# Altium schematic sheet AFBR-TX-fiber_optic_transmiter_OPCn.SchDoc
size A4; SheetNumber: 4; SheetTotal: 4
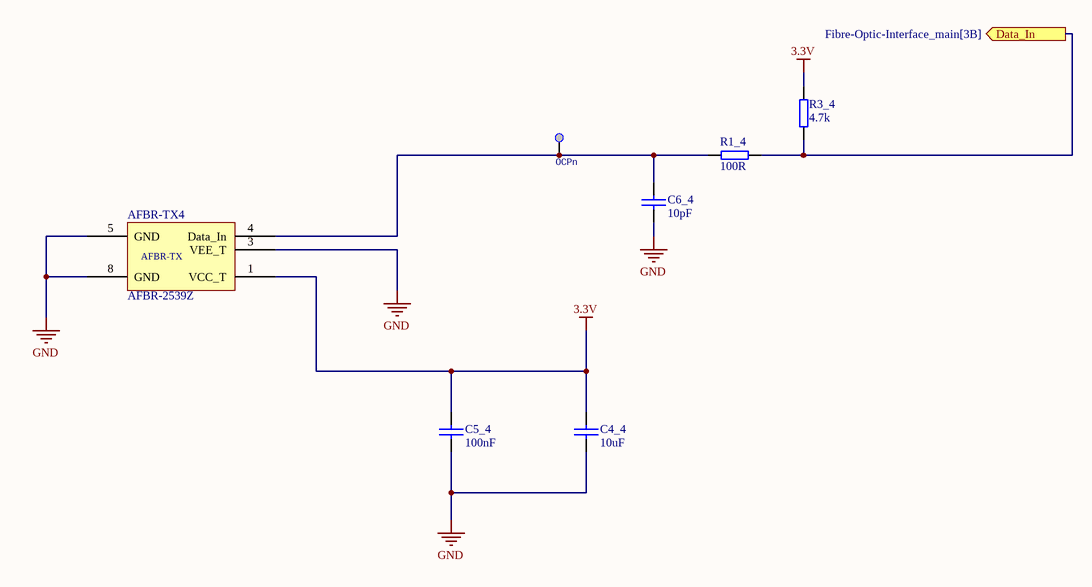
[diagram p0: AFBR-TX-fiber_optic_transmiter_OPCn.SchDoc]

## Parts
AFBR-TX4  AFBR-2539Z  [AFBR-TX/RX-HORIZONTAL]
C4_4  10uF  [1206]
C5_4  100nF  [0603C]
C6_4  10pF  [0603C]
OCPn  PK_1  [PK]  (value not drawn)  (no BOM)
R1_4  100R  [0603R]
R3_4  4.7k  [0603R]

## Ports
Data_In (out, see Fibre-Optic-Interface_main[3B])

## Nets
3.3V: AFBR-TX4.1(VCC_T) C4_4.1 C5_4.1 R3_4.2
GND: AFBR-TX4.3(VEE_T) AFBR-TX4.5(GND) AFBR-TX4.8(GND) C4_4.2 C5_4.2 C6_4.2
Data_In: R1_4.2 R3_4.1 ; port Data_In
NetAFBR-TX4_4: AFBR-TX4.4(Data_In) C6_4.1 OCPn.1 R1_4.1

## Library data of the parts
AFBR-TX4 = AFBR-TX: Fiber Optic Transmitters, Receivers, Transceivers VL V 50MBd RX inv
C4_4 = C_1: Capacitor
C5_4 = C: Capacitor
C6_4 = C_3: Capacitor
OCPn = PK_1: Punkt; ClassName: Mechanical
R1_4 = R_1
R3_4 = R